# Altium schematic sheet TEC power2.SchDoc
size A4
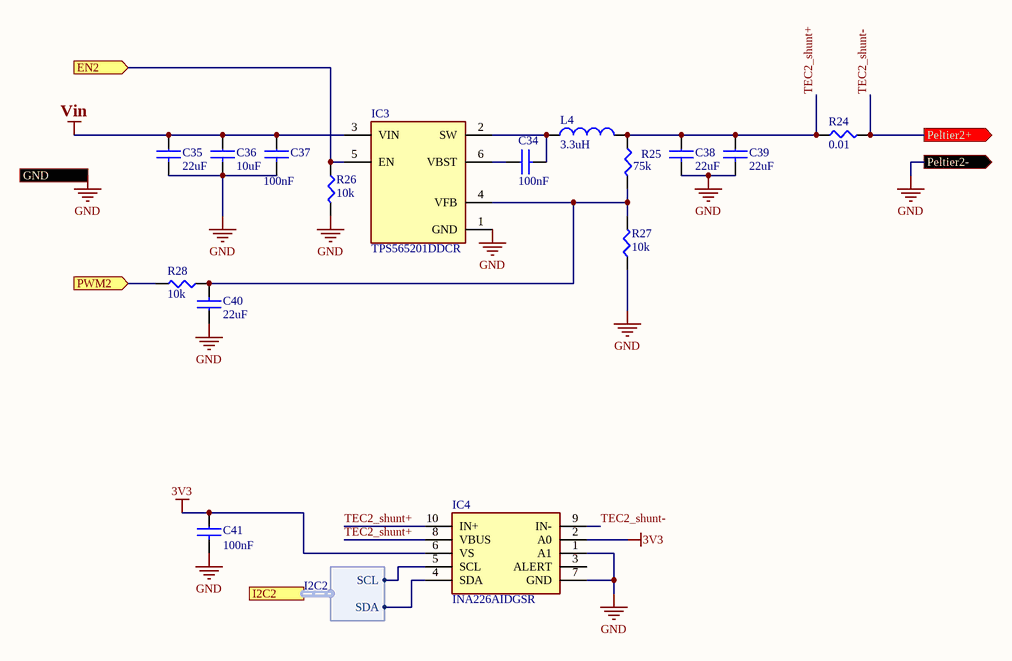
[diagram p0: TEC power2.SchDoc]

## Parts
C34  100nF  [CAPC160X80X90L35N]
C35  22uF  [CAPC200X125X110L50N]
C36  10uF  [CAPC200X125X110L50N]
C37  100nF  [CAPC160X80X90L35N]
C38  22uF  [CAPC200X125X110L50N]
C39  22uF  [CAPC200X125X110L50N]
C40  22uF  [CAPC200X125X110L50N]
C41  100nF  [CAPC160X80X90L35N]
IC3  TPS565201DDCR  [SOT95P280X110-6N]
IC4  INA226AIDGSR  [SOP10P50_300X490X110L55X22N]
L4  3.3uH  [INDM730X660X300L160X290N]
R24  0.01  [RESC200X125X70L40N]
R25  75k  [RESC160X80X90L30N]
R26  10k  [RESC160X80X90L30N]
R27  10k  [RESC160X80X90L30N]
R28  10k  [RESC160X80X90L30N]

## Ports
EN2 (in), GND, I2C2 (harness I2C2), Peltier2+ (out), Peltier2- (out), PWM2 (in)

## Harnesses
I2C2: SCL, SDA

## Nets
3V3: C41.1 IC4.2(A0) IC4.6(VS)
GND: C35.2 C36.2 C37.2 C38.2 C39.2 C40.1 C41.2 IC3.1(GND) IC4.1(A1) IC4.7(GND) R26.2 R27.1 ; port Peltier2-, port GND
Vin: C35.1 C36.1 C37.1 IC3.3(VIN)
EN2: IC3.5(EN) R26.1 ; port EN2
PWM2: R28.2 ; port PWM2
TEC2_shunt+: C38.1 C39.1 IC4.8(VBUS) IC4.10(IN+) L4.2 R24.1 R25.1
TEC2_shunt-: IC4.9(IN-) R24.2 ; port Peltier2+
NetC34_1: C34.1 IC3.6(VBST)
NetC34_2: C34.2 IC3.2(SW) L4.1
NetC40_2: C40.2 IC3.4(VFB) R25.2 R27.2 R28.1
NetIC4_4: IC4.4(SDA) ; port I2C2.SDA
NetIC4_5: IC4.5(SCL) ; port I2C2.SCL

Not connected (* = marked no-connect by the designer): IC4 3(ALERT)

## Library data of the parts
C34 C37 C41 = capacitor: Part Number: CC0603KRX7R9BB104; Value: 100nF; LCSC Part #: C14663
C35 C38-C40 = capacitor: Part Number: CL21A226MAQNNNE; Value: 22uF; LCSC Part #: C45783
C36 = capacitor: Part Number: CL21A106KAYNNNE; Value: 10uF; LCSC Part #: C15850
IC3 = TPS565201DDCR: Integrated Circuit; Manufacturer_Name: Texas Instruments; Datasheet Link: http://www.ti.com/lit/gpn/tps565201; Height: 1.1mm; Manufacturer_Part_Number: TPS565201DDCR
IC4 = INA226AIDGSR: Integrated Circuit; Manufacturer_Name: Texas Instruments; Datasheet Link: https://componentsearchengine.com/Datasheets/1/INA226AIDGSR.pdf; Height: 1.1mm; Mouser2 Part Number: 595-INA226AIDGSR; Mouser2 Price/Stock: https://www.mouser.com/Search/Refine.aspx?Keyword=595-INA226AIDGSR; Manufacturer_Part_Number: INA226AIDGSR; LCSC Part #: C49851
L4 = Inductor: Part Number: MHCI06030-3R3M-R8A; Resistance: 22mOhm; Value: 3.3uH; Package: *; LCSC Part #: C280586
R24 = Resistor: Part Number: 1206W4F100MT5E; Alternatives: 0805W4F100MT5E, 1206W4F100MT5E; Megjegyzes: Eredetileg ez egy: 1206, 0.01ohm, 1206W4F100MT5E; Value: 0.01; LCSC Part #: C127689; Package: 1206
R25 = Resistor: Part Number: 0603WAF7502T5E; Value: 75k; LCSC Part #: C46216; Package: 0805
R26-R28 = Resistor: Part Number: 0603WAF1002T5E; Value: 10k; LCSC Part #: C25804; Package: 0603